# Altium schematic sheet sdram_block.SchDoc
size A4
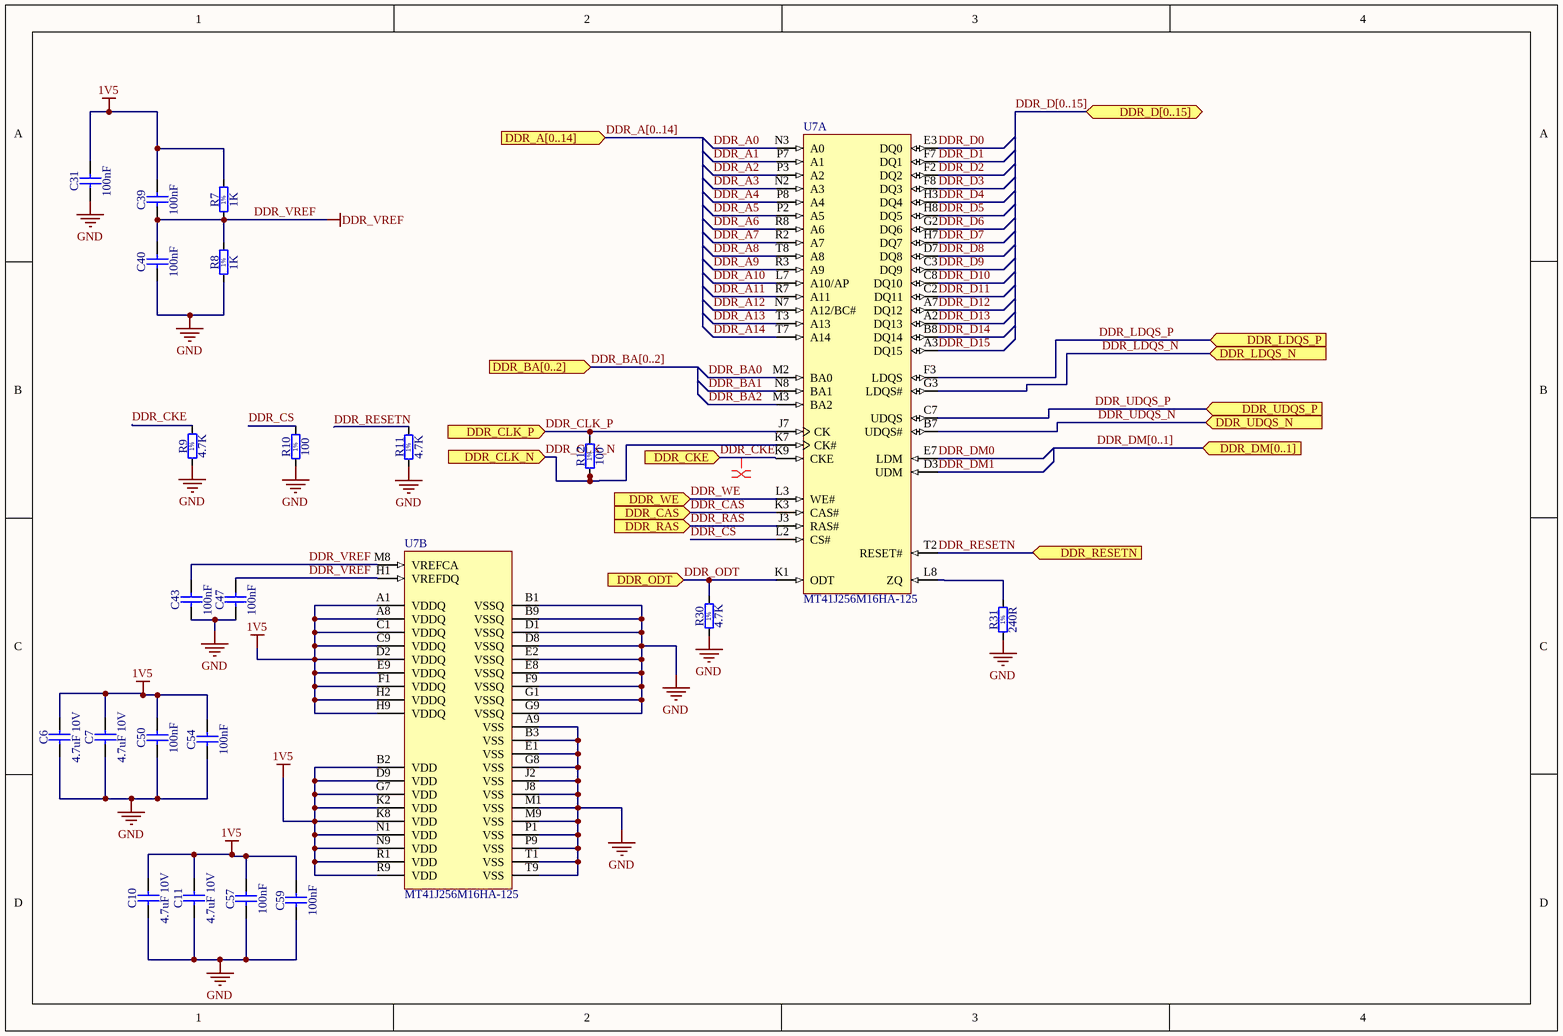
[diagram p0: sdram_block.SchDoc]

## Parts
C6  4.7uF 10V  [CAPC2013X100N]
C7  4.7uF 10V  [CAPC2013X100N]
C10  4.7uF 10V  [CAPC2013X100N]
C11  4.7uF 10V  [CAPC2013X100N]
C31  100nF  [CAPC1005X55N]
C39  100nF  [CAPC1005X55N]
C40  100nF  [CAPC1005X55N]
C43  100nF  [CAPC1005X55N]
C47  100nF  [CAPC1005X55N]
C50  100nF  [CAPC1005X55N]
C54  100nF  [CAPC1005X55N]
C57  100nF  [CAPC1005X55N]
C59  100nF  [CAPC1005X55N]
R7  1K  [RESC1608X55N]
R8  1K  [RESC1608X55N]
R9  4.7K  [RESC1608X55N]
R10  100  [RESC1608X55N]
R11  4.7K  [RESC1608X55N]
R12  100  [RESC1005X40N]
R30  4.7K  [RESC1608X55N]
R31  240R  [RESC1608X55N]
U7  MT41J256M16HA-125  [MICT-HA-96]  (parts A,B of 3)

## Ports
DDR_A[0..14] (in), DDR_BA[0..2] (in), DDR_CAS (in), DDR_CKE (in), DDR_CLK_N (in), DDR_CLK_P (in), DDR_D[0..15] (bidir), DDR_DM[0..1] (in), DDR_LDQS_N (in), DDR_LDQS_P (in), DDR_ODT (in), DDR_RAS (in), DDR_RESETN (in), DDR_UDQS_N (in), DDR_UDQS_P (in), DDR_WE (in)

## Nets
1V5: C6.2 C7.2 C10.2 C11.2 C31.2 C39.2 C50.2 C54.2 C57.2 C59.2 R7.2 U7.A1(VDDQ) U7.A8(VDDQ) U7.B2(VDD) U7.C1(VDDQ) U7.C9(VDDQ) U7.D2(VDDQ) U7.D9(VDD) U7.E9(VDDQ) U7.F1(VDDQ) U7.G7(VDD) U7.H2(VDDQ) U7.H9(VDDQ) U7.K2(VDD) U7.K8(VDD) U7.N1(VDD) U7.N9(VDD) U7.R1(VDD) U7.R9(VDD)
DDR_VREF: C39.1 C40.2 C43.2 C47.2 R7.1 R8.2 U7.H1(VREFDQ) U7.M8(VREFCA)
GND: C6.1 C7.1 C10.1 C11.1 C31.1 C40.1 C43.1 C47.1 C50.1 C54.1 C57.1 C59.1 R8.1 R9.1 R10.1 R11.1 R30.1 R31.1 U7.A9(VSS) U7.B1(VSSQ) U7.B3(VSS) U7.B9(VSSQ) U7.D1(VSSQ) U7.D8(VSSQ) U7.E1(VSS) U7.E2(VSSQ) U7.E8(VSSQ) U7.F9(VSSQ) U7.G1(VSSQ) U7.G8(VSS) U7.G9(VSSQ) U7.J2(VSS) U7.J8(VSS) U7.M1(VSS) U7.M9(VSS) U7.P1(VSS) U7.P9(VSS) U7.T1(VSS) U7.T9(VSS)
DDR_A0: U7.N3(A0)
DDR_A1: U7.P7(A1)
DDR_A2: U7.P3(A2)
DDR_A3: U7.N2(A3)
DDR_A4: U7.P8(A4)
DDR_A5: U7.P2(A5)
DDR_A6: U7.R8(A6)
DDR_A7: U7.R2(A7)
DDR_A8: U7.T8(A8)
DDR_A9: U7.R3(A9)
DDR_A10: U7.L7(A10/AP)
DDR_A11: U7.R7(A11)
DDR_A12: U7.N7(A12/BC#)
DDR_A13: U7.T3(A13)
DDR_A14: U7.T7(A14)
DDR_BA0: U7.M2(BA0)
DDR_BA1: U7.N8(BA1)
DDR_BA2: U7.M3(BA2)
DDR_CAS: U7.K3(CAS#) ; port DDR_CAS
DDR_CKE: R9.2 U7.K9(CKE) ; port DDR_CKE
DDR_CLK_N: R12.1 U7.K7(CK#) ; port DDR_CLK_N
DDR_CLK_P: R12.2 U7.J7(CK) ; port DDR_CLK_P
DDR_CS: R10.2 U7.L2(CS#)
DDR_D0: U7.E3(DQ0)
DDR_D1: U7.F7(DQ1)
DDR_D2: U7.F2(DQ2)
DDR_D3: U7.F8(DQ3)
DDR_D4: U7.H3(DQ4)
DDR_D5: U7.H8(DQ5)
DDR_D6: U7.G2(DQ6)
DDR_D7: U7.H7(DQ7)
DDR_D8: U7.D7(DQ8)
DDR_D9: U7.C3(DQ9)
DDR_D10: U7.C8(DQ10)
DDR_D11: U7.C2(DQ11)
DDR_D12: U7.A7(DQ12)
DDR_D13: U7.A2(DQ13)
DDR_D14: U7.B8(DQ14)
DDR_D15: U7.A3(DQ15)
DDR_DM0: U7.E7(LDM)
DDR_DM1: U7.D3(UDM)
DDR_LDQS_N: U7.G3(LDQS#) ; port DDR_LDQS_N
DDR_LDQS_P: U7.F3(LDQS) ; port DDR_LDQS_P
DDR_ODT: R30.2 U7.K1(ODT) ; port DDR_ODT
DDR_RAS: U7.J3(RAS#) ; port DDR_RAS
DDR_RESETN: R11.2 U7.T2(RESET#) ; port DDR_RESETN
DDR_UDQS_N: U7.B7(UDQS#) ; port DDR_UDQS_N
DDR_UDQS_P: U7.C7(UDQS) ; port DDR_UDQS_P
DDR_WE: U7.L3(WE#) ; port DDR_WE
NetR31_2: R31.2 U7.L8(ZQ)

## Buses and harness runs
bus DDR_A[0..14] = port DDR_A[0..14]
bus DDR_BA[0..2] = port DDR_BA[0..2]
bus DDR_D[0..15] = port DDR_D[0..15]
bus DDR_DM[0..1] = port DDR_DM[0..1]

## Layout directives
rule Width Constraint [Pref Width = 0.1mm    Min Width = 0.1mm    Max Width = 0.2mm]: DDR_CKE

## Notes on the sheet
- (in symbol R0402_100R_1%_0.0625W_100PPM) 1%
- (in symbol R0603_100K_1%_0.1W_100PPM) 1%

## Library data of the parts
C6 C7 C10 C11 = CC0805_1.5NF_50V_5%_C0G: Non-polarised capacitor; Part Description: SMD Multilayer Chip Ceramic Capacitor; Manufacturer: GENERIC; Manufacturer1 Part Number: C0805C152J5GACTU; Value: 1.5nF; Voltage: 50V; TC: C0G/NP0; Tolerance: ±5%; Part Number: CC0805_1.5NF_50V_5%_C0G; Component Kind: Standard; Component Type: Standard; Pin Count: 2; Status: Preferred; Manufacturer Part Number: CC0805_1.5NF_50V_5%_C0G; Case: 0805; Mounted: Yes; Socket: No; SMD: Yes; Sense: No; Manufacturer1 Example: KEMET; Manufacturer1 ComponentHeight: 1mm; HelpURL: \\cern.ch\dfs\Applications\Altium\Datasheets\CC0805_C0G_KEMET_(Commercial Grade).pdf; Author: CERN DEM BC; CreateDate: 18.11.2015; LatestRevisionDate: 18.11.2015
C31 C39 C40 C43 C47 C50 C54 C57 C59 = CC0402_100NF_16V_10%_X5R: Non-polarised capacitor; Part Description: SMD Multilayer Chip Ceramic Capacitor; Manufacturer: GENERIC; Manufacturer1 Part Number: GRM155R61C104KA88D; Voltage: 16V; TC: X5R; Tolerance: ±10%; Part Number: CC0402_100NF_16V_10%_X5R; Component Kind: Standard; Component Type: Standard; Pin Count: 2; Value: 100nF; Status: None; Manufacturer Part Number: CC0402_100NF_16V_10%_X5R; Case: 0402; Mounted: Yes; Socket: No; SMD: Yes; Sense: No; Manufacturer1 Example: MURATA; Manufacturer1 ComponentHeight: 0.55mm; HelpURL: \\cern.ch\dfs\Applications\Altium\Datasheets\CC0402_X5R_MURATA_GRM.pdf; Author: CERN DEM JLC; CreateDate: 10.12.2013; LatestRevisionDate: 10.12.2013
R7-R11 R30 R31 = R0603_100K_1%_0.1W_100PPM: Resistor - 1%; Part Description: General Purpose Thick Film Chip Resistor; Manufacturer: GENERIC; Manufacturer1 Part Number: NRC06F1003TRF; Value: 100k; Power: 0.1W; TC: ±100ppm/°C; PressFit: No; Part Number: R0603_100K_1%_0.1W_100PPM; Component Kind: Standard; Component Type: Standard; Pin Count: 2; Status: Preferred; Tolerance: ±1%; Manufacturer Part Number: R0603_100K_1%_0.1W_100PPM; Case: 0603; Mounted: Yes; Sense: No; Socket: No; SMD: Yes; Manufacturer1 Example: NIC COMPONENT; Manufacturer1 ComponentHeight: 0.55mm; HelpURL: \\cern.ch\dfs\Applications\Altium\Datasheets\R0603_NIC_NRC.pdf; Author: CERN DEM JLC; CreateDate: 03.12.2007; LatestRevisionDate: 13.03.2008
R12 = R0402_100R_1%_0.0625W_100PPM: Resistor - 1%; Part Description: General Purpose Thick Film Chip Resistor; Manufacturer: GENERIC; Manufacturer1 Part Number: 232270671001L; TC: ±100ppm/°C; PressFit: No; Part Number: R0402_100R_1%_0.0625W_100PPM; Component Kind: Standard; Component Type: Standard; Pin Count: 2; Value: 100; Status: Not Recommended; Power: 0.0625W; Tolerance: ±1%; Manufacturer Part Number: R0402_100R_1%_0.0625W_100PPM; Case: 0402; Mounted: Yes; Sense: No; Socket: No; SMD: Yes; Manufacturer1 Example: YAGEO PHYCOMP; Manufacturer1 ComponentHeight: 0.4mm; HelpURL: \\cern.ch\dfs\Applications\Altium\Datasheets\R0402_Phycomp_RC0402.pdf; Author: CERN DEM JLC; CreateDate: 03.12.2007; LatestRevisionDate: 17.10.2012
U7 = MT41J256M16HA-125: 4Gb DDR3-1600 SDRAM, 256Mb x 16, 1.25ns, 1.5V, 0 to 95 degC, 96-Ball FBGA, Pb-Free; Manufacturer: Micron; CL: CL = 11; Clock Rate: 800 MHz; Op. Temp.: 0C to +95C; DatasheetVersion: Rev.J; PackageVersion: Rev.E; PackageReference: MICT-HA-96; PackageDescription: 96-Ball Fine-Pitch Ball Grid Array, 14 x 9 mm, Pitch 0.8 mm; Cycle Time: 1.25ns; Data Rate: DDR3-1600; Density: 4Gb; Depth: 256Mb; Package: FBGA; Pin Count: 96-ball; RoHS: Yes; Voltage: 1.5V; Width: x16; Mounting Technology: Surface Mount; PartNumber: MT41J256M16HA-125; ComponentLink1Description: Manufacturer URL; ComponentLink1URL: http://www.micron.com/; ComponentLink2Description: Datasheet; ComponentLink2URL: http://www.micron.com/~/media/Documents/Products/Data%20Sheet/DRAM/4Gb_DDR3_SDRAM.pdf; ComponentLink3Description: Package Specification; ComponentLink3URL: http://www.micron.com/~/media/Documents/Products/Data%20Sheet/DRAM/4Gb_1_35V_DDR3L.pdf